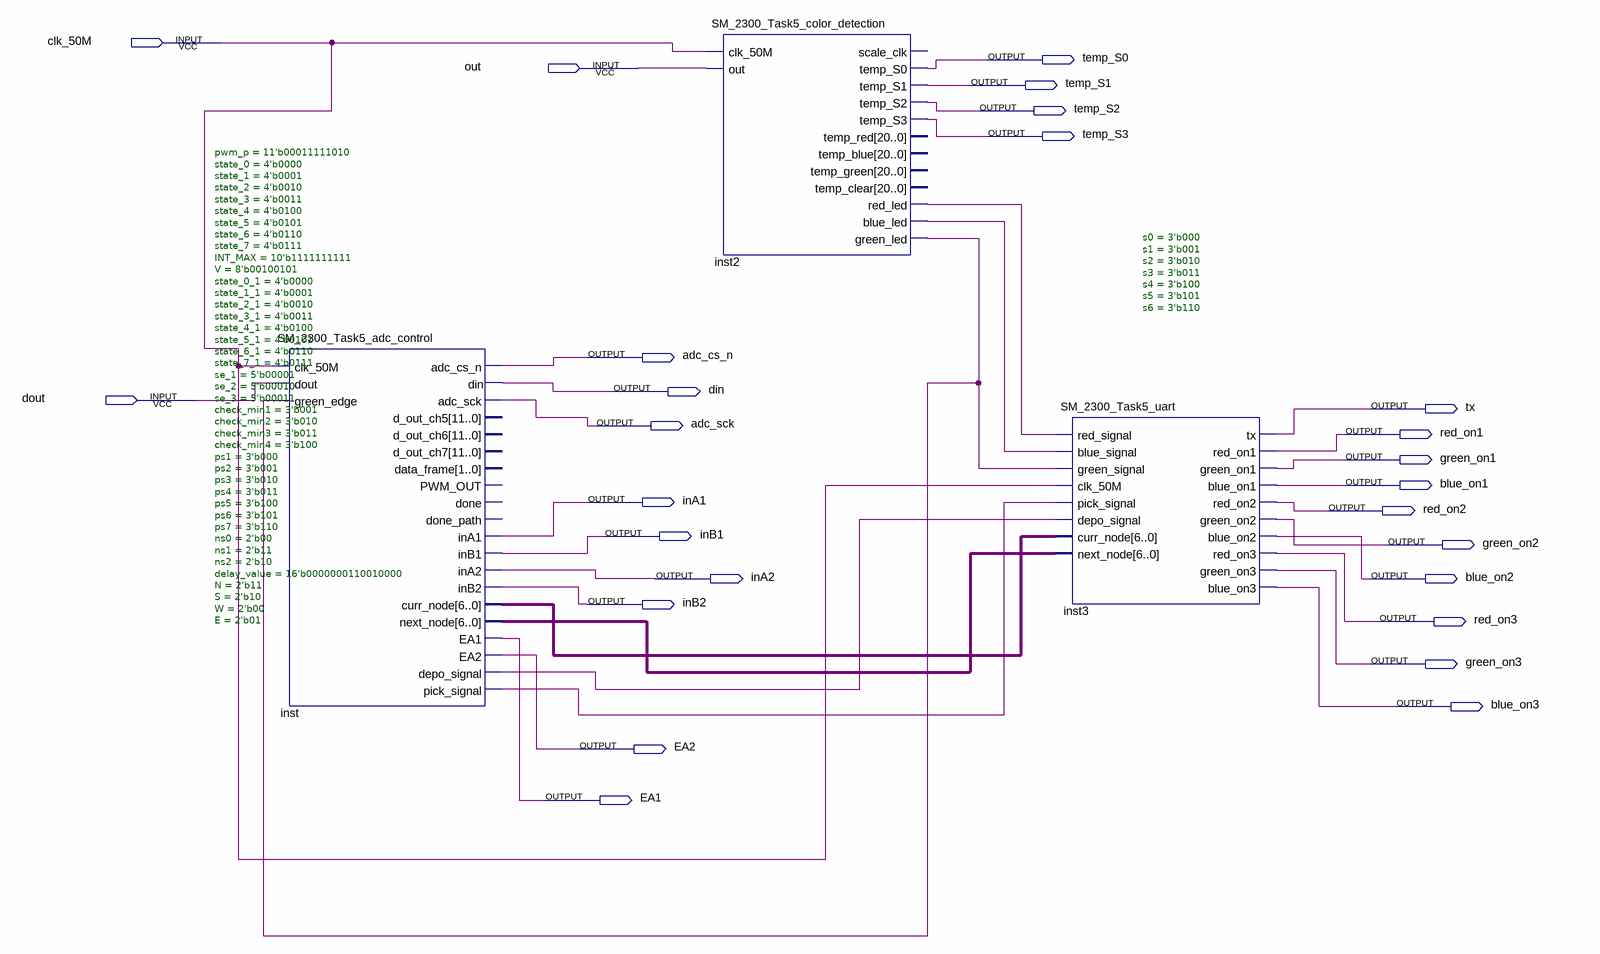
[diagram p0: schematic sheet]
// Quartus schematic cs2.bdf as structural Verilog: 3 symbols, 26 pins
module cs2 (
  input  clk_50M,
  input  out,
  input  dout,
  output temp_S0,
  output temp_S1,
  output temp_S2,
  output temp_S3,
  output adc_cs_n,
  output din,
  output tx,
  output adc_sck,
  output red_on1,
  output green_on1,
  output blue_on1,
  output inA1,
  output red_on2,
  output inB1,
  output green_on2,
  output inA2,
  output blue_on2,
  output inB2,
  output red_on3,
  output green_on3,
  output blue_on3,
  output EA2,
  output EA1
);

  wire inst2_blue_led, inst2_green_led, inst2_red_led, inst_depo_signal, inst_pick_signal;
  wire [6:0] inst_curr_node, inst_next_node;

  SM_2300_Task5_adc_control #(.pwm_p(11'b00011111010), .state_0(4'b0000), .state_1(4'b0001), .state_2(4'b0010), .state_3(4'b0011), .state_4(4'b0100), .state_5(4'b0101), .state_6(4'b0110), .state_7(4'b0111), .INT_MAX(10'b1111111111), .V(8'b00100101), .state_0_1(4'b0000), .state_1_1(4'b0001), .state_2_1(4'b0010), .state_3_1(4'b0011), .state_4_1(4'b0100), .state_5_1(4'b0101), .state_6_1(4'b0110), .state_7_1(4'b0111), .se_1(5'b00001), .se_2(5'b00010), .se_3(5'b00011), .check_min1(3'b001), .check_min2(3'b010), .check_min3(3'b011), .check_min4(3'b100), .ps1(3'b000), .ps2(3'b001), .ps3(3'b010), .ps4(3'b011), .ps5(3'b100), .ps6(3'b101), .ps7(3'b110), .ns0(2'b00), .ns1(2'b11), .ns2(2'b10), .delay_value(16'b0000000110010000), .N(2'b11), .S(2'b10), .W(2'b00), .E(2'b01)) inst (
    .clk_50M(clk_50M), .dout(dout), .green_edge(inst2_green_led), .adc_cs_n(adc_cs_n), .din(din),
    .adc_sck(adc_sck), .inA1(inA1), .inB1(inB1), .inA2(inA2), .inB2(inB2), .curr_node(inst_curr_node),
    .next_node(inst_next_node), .EA1(EA1), .EA2(EA2), .depo_signal(inst_depo_signal),
    .pick_signal(inst_pick_signal));  // open: d_out_ch5, d_out_ch6, d_out_ch7, data_frame, PWM_OUT, done, done_path
  SM_2300_Task5_color_detection inst2 (
    .clk_50M(clk_50M), .out(out), .temp_S0(temp_S0), .temp_S1(temp_S1), .temp_S2(temp_S2), .temp_S3(temp_S3),
    .red_led(inst2_red_led), .blue_led(inst2_blue_led), .green_led(inst2_green_led));  // open: scale_clk, temp_red, temp_blue, temp_green, temp_clear
  SM_2300_Task5_uart #(.s0(3'b000), .s1(3'b001), .s2(3'b010), .s3(3'b011), .s4(3'b100), .s5(3'b101), .s6(3'b110)) inst3 (
    .red_signal(inst2_red_led), .blue_signal(inst2_blue_led), .green_signal(inst2_green_led),
    .clk_50M(clk_50M), .pick_signal(inst_pick_signal), .depo_signal(inst_depo_signal),
    .curr_node(inst_curr_node), .next_node(inst_next_node), .tx(tx), .red_on1(red_on1),
    .green_on1(green_on1), .blue_on1(blue_on1), .red_on2(red_on2), .green_on2(green_on2),
    .blue_on2(blue_on2), .red_on3(red_on3), .green_on3(green_on3), .blue_on3(blue_on3));
endmodule
